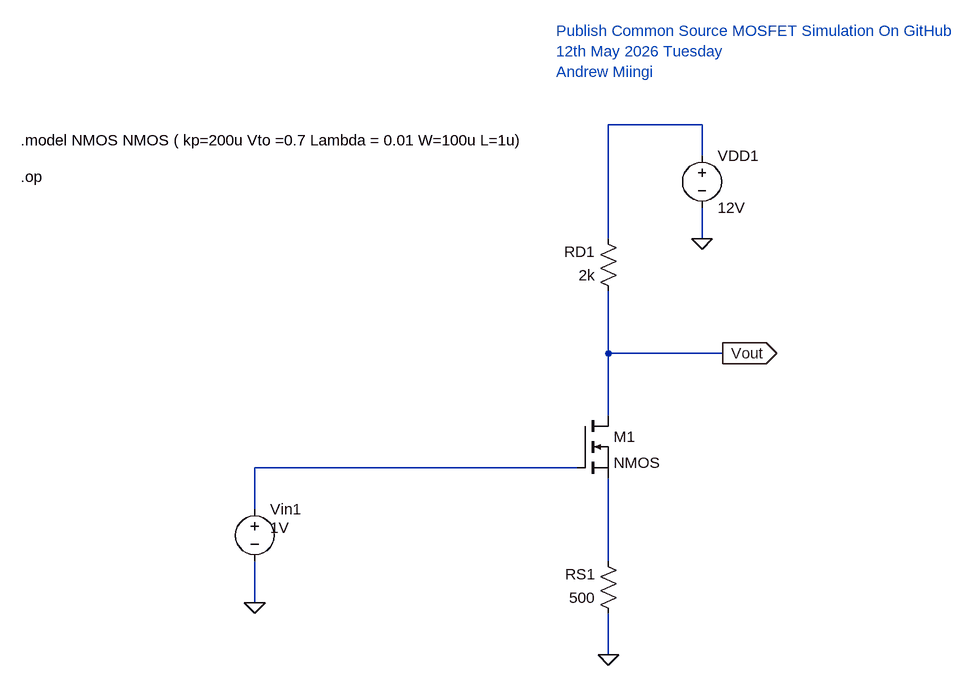
[diagram p0: schematic Common_Source_MOSFET_3.asc]
Common_Source_MOSFET_3.asc, the LTspice schematic file:
Version 4
SHEET 1 1124 836
WIRE 704 -16 560 -16
WIRE 704 32 704 -16
WIRE 560 160 560 -16
WIRE 704 160 704 112
WIRE 560 336 560 240
WIRE 736 336 560 336
WIRE 560 432 560 336
WIRE 512 512 16 512
WIRE 16 576 16 512
WIRE 560 656 560 528
WIRE 16 720 16 656
WIRE 560 800 560 736
FLAG 16 720 0
FLAG 560 800 0
FLAG 704 160 0
FLAG 736 336 Vout
IOPIN 736 336 Out
SYMBOL nmos 512 432 R0
SYMATTR InstName M1
SYMBOL res 576 256 R180
WINDOW 0 36 76 Left 2
WINDOW 3 36 40 Left 2
SYMATTR InstName RD1
SYMATTR Value 2k
SYMBOL res 576 752 R180
WINDOW 0 36 76 Left 2
WINDOW 3 36 40 Left 2
SYMATTR InstName RS1
SYMATTR Value 500
SYMBOL voltage 16 560 R0
WINDOW 123 24 124 Left 2
WINDOW 39 0 0 Left 0
WINDOW 3 24 44 Left 2
SYMATTR InstName Vin1
SYMATTR Value 1V
SYMBOL voltage 704 16 R0
SYMATTR InstName VDD1
SYMATTR Value 12V
TEXT -344 8 Left 2 !.model NMOS NMOS ( kp=200u Vto =0.7 Lambda = 0.01 W=100u L=1u)
TEXT 480 -160 Left 2 ;Publish Common Source MOSFET Simulation On GitHub\n12th May 2026 Tuesday\nAndrew Miingi
TEXT -344 64 Left 2 !.op

The netlist it stands for:
* Common_Source_MOSFET_3.asc
M1 Vout N002 N003 N003 NMOS
RD1 Vout N001 2k
RS1 0 N003 500
Vin1 N002 0 1V
VDD1 N001 0 12V
.model NMOS NMOS
.model PMOS PMOS
.lib standard.mos
.model NMOS NMOS ( kp=200u Vto =0.7 Lambda = 0.01 W=100u L=1u)
* Publish Common Source MOSFET Simulation On GitHub
* 12th May 2026 Tuesday
* Andrew Miingi
.op
.backanno
.end